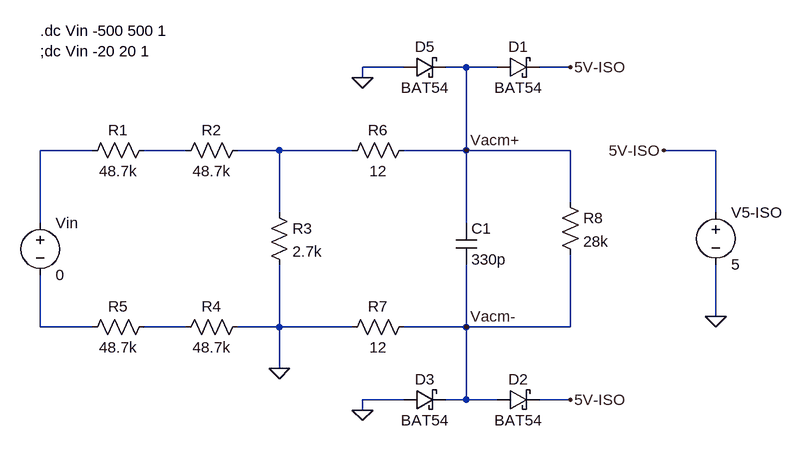
[diagram p0: schematic input-overvoltage-protection.asc]
input-overvoltage-protection.asc, the LTspice schematic file:
Version 4
SHEET 1 1104 680
WIRE 512 -80 448 -80
WIRE 608 -80 576 -80
WIRE 656 -80 608 -80
WIRE 768 -80 720 -80
WIRE 448 -64 448 -80
WIRE 32 48 -48 48
WIRE 176 48 112 48
WIRE 320 48 256 48
WIRE 432 48 320 48
WIRE 608 48 608 -80
WIRE 608 48 512 48
WIRE 768 48 608 48
WIRE 992 48 912 48
WIRE 768 128 768 48
WIRE 320 144 320 48
WIRE 992 144 992 48
WIRE -48 160 -48 48
WIRE 608 160 608 48
WIRE 992 304 992 224
WIRE -48 320 -48 240
WIRE 32 320 -48 320
WIRE 176 320 112 320
WIRE 320 320 320 224
WIRE 320 320 256 320
WIRE 432 320 320 320
WIRE 608 320 608 224
WIRE 608 320 512 320
WIRE 768 320 768 208
WIRE 768 320 608 320
WIRE 320 384 320 320
WIRE 512 432 448 432
WIRE 608 432 608 320
WIRE 608 432 576 432
WIRE 656 432 608 432
WIRE 768 432 720 432
WIRE 448 448 448 432
FLAG 992 304 0
FLAG 912 48 5V-ISO
FLAG 448 -64 0
FLAG 768 -80 5V-ISO
FLAG 448 448 0
FLAG 768 432 5V-ISO
FLAG 320 384 0
FLAG 608 48 Vacm+
FLAG 608 320 Vacm-
SYMBOL voltage -48 144 R0
WINDOW 123 0 0 Left 0
WINDOW 39 0 0 Left 0
SYMATTR InstName Vin
SYMATTR Value 0
SYMBOL res 16 64 R270
WINDOW 0 32 56 VTop 2
WINDOW 3 0 56 VBottom 2
SYMATTR InstName R1
SYMATTR Value 48.7k
SYMBOL res 304 128 R0
SYMATTR InstName R3
SYMATTR Value 2.7k
SYMBOL res 416 64 R270
WINDOW 0 32 56 VTop 2
WINDOW 3 0 56 VBottom 2
SYMATTR InstName R6
SYMATTR Value 12
SYMBOL cap 592 160 R0
SYMATTR InstName C1
SYMATTR Value 330p
SYMBOL res 160 64 R270
WINDOW 0 32 56 VTop 2
WINDOW 3 0 56 VBottom 2
SYMATTR InstName R2
SYMATTR Value 48.7k
SYMBOL res 272 304 R90
WINDOW 0 0 56 VBottom 2
WINDOW 3 32 56 VTop 2
SYMATTR InstName R4
SYMATTR Value 48.7k
SYMBOL res 128 304 R90
WINDOW 0 0 56 VBottom 2
WINDOW 3 32 56 VTop 2
SYMATTR InstName R5
SYMATTR Value 48.7k
SYMBOL res 528 304 R90
WINDOW 0 0 56 VBottom 2
WINDOW 3 32 56 VTop 2
SYMATTR InstName R7
SYMATTR Value 12
SYMBOL voltage 992 128 R0
WINDOW 123 0 0 Left 0
WINDOW 39 0 0 Left 0
SYMATTR InstName V5-ISO
SYMATTR Value 5
SYMBOL schottky 512 -64 R270
WINDOW 0 32 32 VTop 2
WINDOW 3 0 32 VBottom 2
SYMATTR InstName D5
SYMATTR Value BAT54
SYMATTR Description Diode
SYMATTR Type diode
SYMBOL res 752 112 R0
SYMATTR InstName R8
SYMATTR Value 28k
SYMBOL schottky 656 -64 R270
WINDOW 0 32 32 VTop 2
WINDOW 3 0 32 VBottom 2
SYMATTR InstName D1
SYMATTR Value BAT54
SYMATTR Description Diode
SYMATTR Type diode
SYMBOL schottky 656 448 R270
WINDOW 0 32 32 VTop 2
WINDOW 3 0 32 VBottom 2
SYMATTR InstName D2
SYMATTR Value BAT54
SYMATTR Description Diode
SYMATTR Type diode
SYMBOL schottky 512 448 R270
WINDOW 0 32 32 VTop 2
WINDOW 3 0 32 VBottom 2
SYMATTR InstName D3
SYMATTR Value BAT54
SYMATTR Description Diode
SYMATTR Type diode
TEXT -48 -136 Left 2 !.dc Vin -500 500 1\n;dc Vin -20 20 1

The netlist it stands for:
* input-overvoltage-protection.asc
Vin N001 N004 0
R1 N001 N002 48.7k
R3 N003 0 2.7k
R6 N003 Vacm+ 12
C1 Vacm+ Vacm- 330p
R2 N002 N003 48.7k
R4 0 N005 48.7k
R5 N005 N004 48.7k
R7 Vacm- 0 12
V5-ISO 5V-ISO 0 5
D5 0 Vacm+ BAT54
R8 Vacm+ Vacm- 28k
D1 Vacm+ 5V-ISO BAT54
D2 Vacm- 5V-ISO BAT54
D3 0 Vacm- BAT54
.model D D
.lib standard.dio
.dc Vin -500 500 1
;dc Vin -20 20 1
.backanno
.end

* Results of the author's LTspice run, read from the files saved beside the schematic
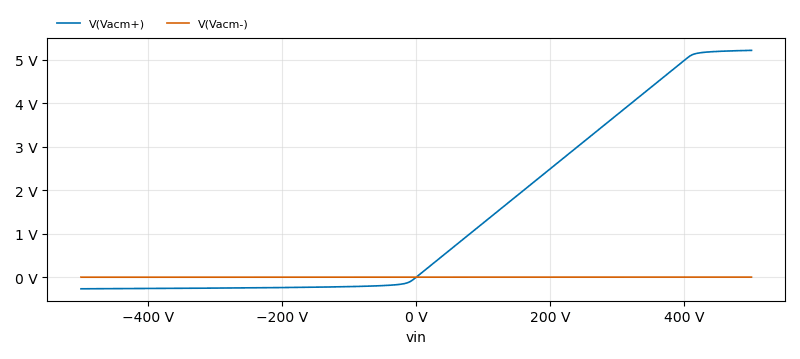
[diagram p1: DC transfer characteristic of input-overvoltage-protection.asc, plotted from the saved traces]
* DC transfer characteristic, 1 run:
*   V(Vacm+): -266.7 mV at vin=-500 V, 5.217 V at vin=500 V, min -266.7 mV, max 5.217 V
*   V(Vacm-): -113.1 µV at vin=-500 V, 2.236 mV at vin=500 V, min -113.1 µV, max 2.236 mV